# Altium schematic sheet main.SchDoc
size A4; SheetNumber: 1; SheetTotal: 5
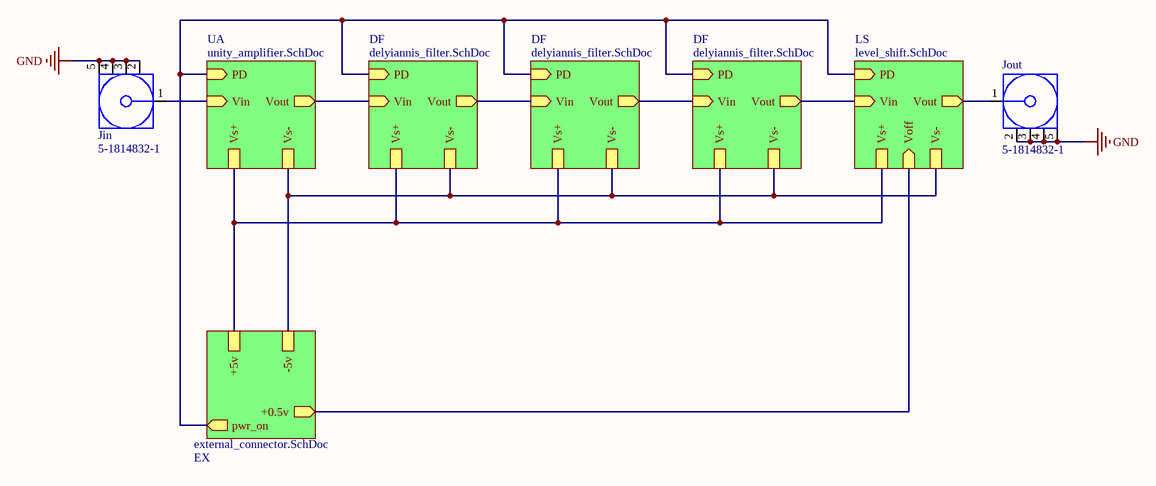
[diagram p0: main.SchDoc]

## Parts
Jin  5-1814832-1  [TECO-5-1814832-1_V]
Jout  5-1814832-1  [TECO-5-1814832-1_V]

## Sub-sheets
DF = delyiannis_filter.SchDoc: Vs+, PD (in), Vin (in), Vs-, Vout (out)
DF = delyiannis_filter.SchDoc: Vs+, PD (in), Vin (in), Vs-, Vout (out)
DF = delyiannis_filter.SchDoc: Vs+, PD (in), Vin (in), Vs-, Vout (out)
EX = external_connector.SchDoc: +5v, -5v, pwr_on (out), +0.5v (out)
LS = level_shift.SchDoc: Vs+, PD (in), Vin (in), Vs-, Vout (out), Voff (in)
UA = unity_amplifier.SchDoc: Vs+, PD (in), Vin (in), Vs-, Vout (out)

## Nets
GND: Jin.2 Jin.3 Jin.4 Jin.5 Jout.2 Jout.3 Jout.4 Jout.5
NetJin_1: Jin.1 ; sheet UA/Vin
NetJout_1: Jout.1 ; sheet LS/Vout
(unnamed): sheet UA/Vs+, sheet DF/Vs+, sheet DF/Vs+, sheet DF/Vs+, sheet LS/Vs+, sheet EX/+5v
(unnamed): sheet UA/PD, sheet DF/PD, sheet DF/PD, sheet DF/PD, sheet LS/PD, sheet EX/pwr_on
(unnamed): sheet UA/Vs-, sheet DF/Vs-, sheet DF/Vs-, sheet DF/Vs-, sheet LS/Vs-, sheet EX/-5v
(unnamed): sheet UA/Vout, sheet DF/Vin
(unnamed): sheet DF/Vout, sheet DF/Vin
(unnamed): sheet DF/Vout, sheet DF/Vin
(unnamed): sheet DF/Vout, sheet LS/Vin
(unnamed): sheet LS/Voff, sheet EX/+0.5v

## Library data of the parts
Jin Jout = CMP-2000-05415-1: SMA Connector, Pitch 5.08 mm, 1 Position, Height 9.5 mm, Tail Length 4 mm, -65 to 165 degC, RoHS, Bulk; Manufacturer: TE Connectivity; Connector Mounting: PCBMount; Connector Body Style: StraightJack; Impedance: 50ohm; Coaxial Termination: Solder; SVHC: NoSVHC(15-Jun-2015); Frequency Max: 3GHz; Product Range: ZDCSeries; Connector Type: SMACoaxial; Datasheet Version: Rev. B1, 03/2011; Package Reference: 5-1814832-1; Package Description: SMA Connector, Pitch 5.08 mm, 1 Position, Height 9.5 mm, Tail Length 4 mm; Contact Plating: GoldPlatedContacts; Coaxial Cable Types: -; Contact Material: BerylliumCopper; Manufacturer URL: http://www.te.com/; Datasheet URL: http://www.onlinecomponents.com/productFiles/mf-AMP/eng_cd_1814832_a.pdf